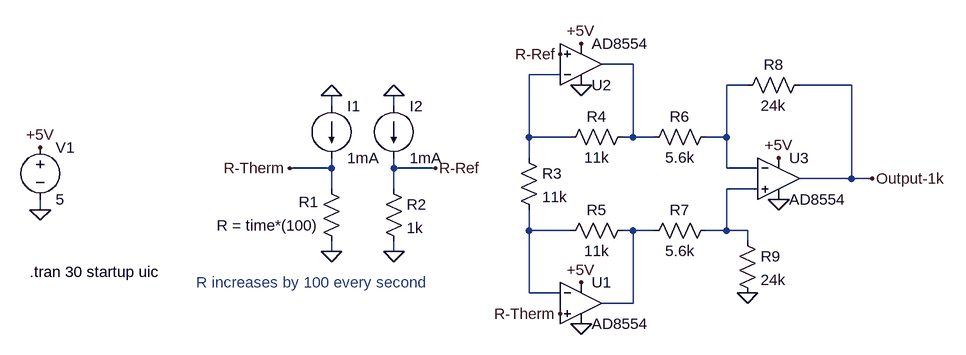
[diagram p0: schematic Draft1.asc]
Draft1.asc, the LTspice schematic file:
Version 4
SHEET 1 1384 680
WIRE 864 -112 816 -112
WIRE 752 -96 704 -96
WIRE 1040 -80 1008 -80
WIRE 1200 -80 1120 -80
WIRE 400 -48 400 -64
WIRE 496 -48 496 -64
WIRE 704 0 704 -96
WIRE 768 0 704 0
WIRE 864 0 864 -112
WIRE 864 0 848 0
WIRE 896 0 864 0
WIRE 1008 0 1008 -80
WIRE 1008 0 976 0
WIRE 704 32 704 0
WIRE 400 48 400 32
WIRE 400 48 336 48
WIRE 496 48 496 32
WIRE 560 48 496 48
WIRE 1008 48 1008 0
WIRE 1056 48 1008 48
WIRE 1200 64 1200 -80
WIRE 1200 64 1120 64
WIRE 1232 64 1200 64
WIRE 400 80 400 48
WIRE 496 80 496 48
WIRE 1056 80 1008 80
WIRE -48 112 -48 96
WIRE 704 144 704 112
WIRE 768 144 704 144
WIRE 864 144 848 144
WIRE 896 144 864 144
WIRE 1008 144 1008 80
WIRE 1008 144 976 144
WIRE 1040 144 1008 144
WIRE 1040 160 1040 144
WIRE 400 176 400 160
WIRE 496 176 496 160
WIRE 704 240 704 144
WIRE 752 240 704 240
WIRE 864 256 864 144
WIRE 864 256 816 256
FLAG 400 -64 0
FLAG 496 -64 0
FLAG 496 176 0
FLAG 400 176 0
FLAG 336 48 R-Therm
FLAG 560 48 R-Ref
FLAG -48 112 0
FLAG -48 16 +5V
FLAG 784 288 0
FLAG 784 -80 0
FLAG 1088 96 0
FLAG 784 224 +5V
FLAG 784 -144 +5V
FLAG 1088 32 +5V
FLAG 1232 64 Output-1k
FLAG 1040 240 0
FLAG 752 272 R-Therm
FLAG 752 -128 R-Ref
SYMBOL current 400 -48 R0
WINDOW 123 0 0 Left 0
WINDOW 39 0 0 Left 0
SYMATTR InstName I1
SYMATTR Value 1mA
SYMBOL current 496 -48 R0
WINDOW 123 0 0 Left 0
WINDOW 39 0 0 Left 0
SYMATTR InstName I2
SYMATTR Value 1mA
SYMBOL res 416 176 R180
WINDOW 0 36 76 Left 2
WINDOW 3 36 40 Left 2
SYMATTR InstName R1
SYMATTR Value R = time*(100)
SYMBOL res 480 64 R0
SYMATTR InstName R2
SYMATTR Value 1k
SYMBOL voltage -48 0 R0
WINDOW 123 0 0 Left 0
WINDOW 39 0 0 Left 0
SYMATTR InstName V1
SYMATTR Value 5
SYMBOL res 688 16 R0
SYMATTR InstName R3
SYMATTR Value 11k
SYMBOL res 864 -16 R90
WINDOW 0 0 56 VBottom 2
WINDOW 3 32 56 VTop 2
SYMATTR InstName R4
SYMATTR Value 11k
SYMBOL res 752 160 R270
WINDOW 0 32 56 VTop 2
WINDOW 3 0 56 VBottom 2
SYMATTR InstName R5
SYMATTR Value 11k
SYMBOL res 992 -16 R90
WINDOW 0 0 56 VBottom 2
WINDOW 3 32 56 VTop 2
SYMATTR InstName R6
SYMATTR Value 5.6k
SYMBOL res 880 160 R270
WINDOW 0 32 56 VTop 2
WINDOW 3 0 56 VBottom 2
SYMATTR InstName R7
SYMATTR Value 5.6k
SYMBOL res 1136 -96 R90
WINDOW 0 0 56 VBottom 2
WINDOW 3 32 56 VTop 2
SYMATTR InstName R8
SYMATTR Value 24k
SYMBOL res 1024 144 R0
SYMATTR InstName R9
SYMATTR Value 24k
SYMBOL OpAmps\\AD8554 784 192 R0
SYMATTR InstName U1
SYMBOL OpAmps\\AD8554 784 -48 M180
SYMATTR InstName U2
SYMBOL OpAmps\\AD8554 1088 0 R0
SYMATTR InstName U3
TEXT -64 208 Left 2 !.tran 30 startup uic
TEXT 192 224 Left 2 ;R increases by 100 every second

The netlist it stands for:
* Draft1.asc
I1 0 R-Therm 1mA
I2 0 R-Ref 1mA
R1 0 R-Therm R = time*(100)
R2 R-Ref 0 1k
V1 +5V 0 5
R3 N002 N005 11k
R4 N001 N002 11k
R5 N005 N006 11k
R6 N003 N001 5.6k
R7 N006 N004 5.6k
R8 Output-1k N003 24k
R9 N004 0 24k
XU1 R-Therm N005 +5V 0 N006 AD8554  ; pins In+ In- V+ V- OUT
XU2 R-Ref N002 0 +5V N001 AD8554  ; pins In+ In- V+ V- OUT
XU3 N004 N003 +5V 0 Output-1k AD8554  ; pins In+ In- V+ V- OUT
.tran 30 startup uic
* R increases by 100 every second
.backanno
.end

* Results of the author's LTspice run, read from the files saved beside the schematic
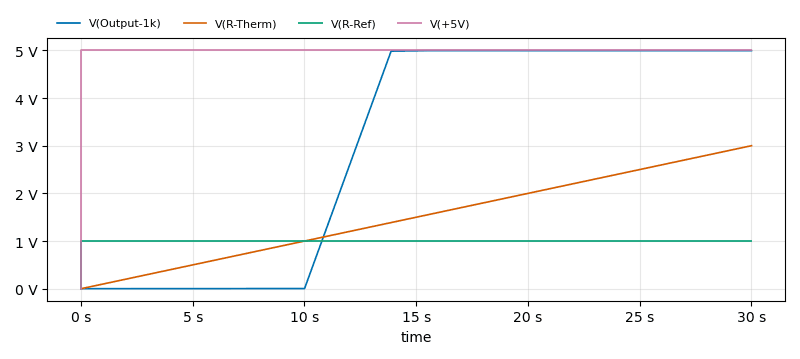
[diagram p1: Transient Analysis of Draft1.asc, plotted from the saved traces]
* Transient Analysis, 1 run:
*   V(Output-1k): min 0 V, max 4.996 V, average 3.006 V, rms 3.83 V, last 4.994 V
*   V(R-Therm): min 0 V, max 3 V, average 1.5 V, rms 1.738 V, last 3 V
*   V(R-Ref): min -1.42 mV, max 1 V, average 1 V, rms 1 V, last 1 V
*   V(+5V): min 0 V, max 5 V, average 5 V, rms 5 V, last 5 V